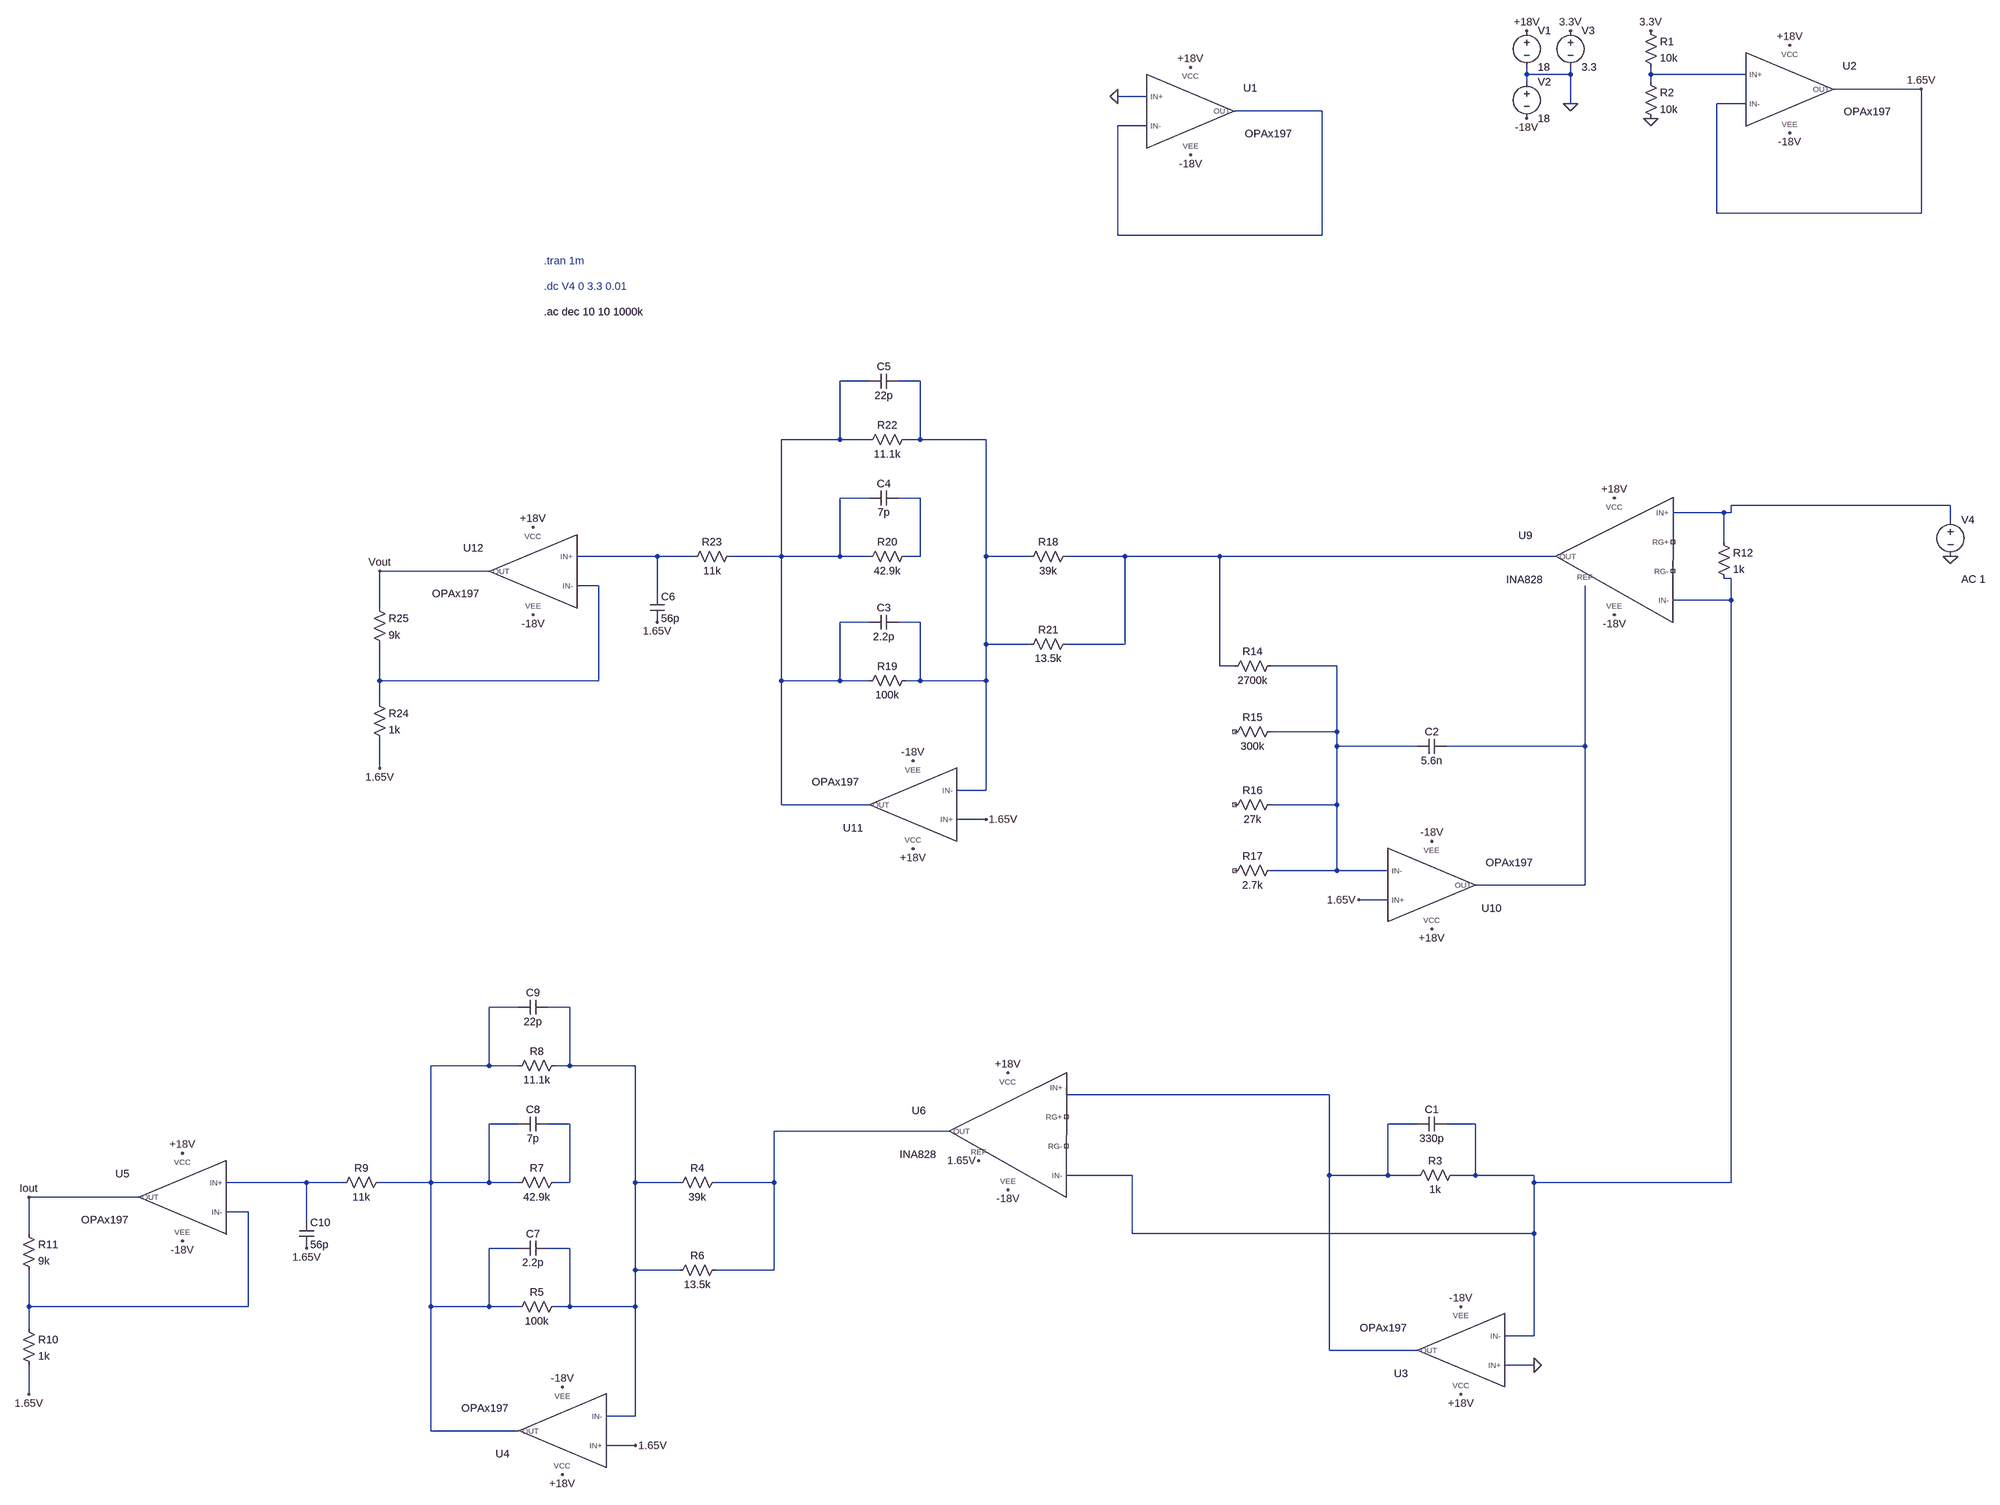
[diagram p0: schematic big.asc]
big.asc, the LTspice schematic file:
Version 4.1
SHEET 1 2076 5472
WIRE 896 48 896 32
WIRE 992 48 992 32
WIRE 992 48 896 48
WIRE 1168 48 1168 32
WIRE 1376 48 1168 48
WIRE 896 64 896 48
WIRE 1168 64 1168 48
WIRE 1760 80 1568 80
WIRE 64 96 0 96
WIRE 992 112 992 48
WIRE 1376 112 1312 112
WIRE 448 128 256 128
WIRE 64 160 0 160
WIRE 1312 352 1312 112
WIRE 1760 352 1760 80
WIRE 1760 352 1312 352
WIRE 0 400 0 160
WIRE 448 400 448 128
WIRE 448 400 0 400
WIRE -544 2048 -608 2048
WIRE -432 2048 -480 2048
WIRE -608 2176 -608 2048
WIRE -608 2176 -736 2176
WIRE -544 2176 -608 2176
WIRE -432 2176 -432 2048
WIRE -432 2176 -464 2176
WIRE -288 2176 -432 2176
WIRE -544 2304 -608 2304
WIRE -432 2304 -480 2304
WIRE 1824 2320 1344 2320
WIRE 1328 2336 1216 2336
WIRE 1344 2336 1344 2320
WIRE 1344 2336 1328 2336
WIRE 1824 2352 1824 2320
WIRE 1328 2400 1328 2336
WIRE -1008 2432 -1184 2432
WIRE -928 2432 -1008 2432
WIRE -736 2432 -736 2176
WIRE -736 2432 -848 2432
WIRE -608 2432 -608 2304
WIRE -608 2432 -736 2432
WIRE -544 2432 -608 2432
WIRE -432 2432 -432 2304
WIRE -432 2432 -464 2432
WIRE -288 2432 -288 2176
WIRE -192 2432 -288 2432
WIRE 16 2432 -112 2432
WIRE 224 2432 16 2432
WIRE 960 2432 224 2432
WIRE -1376 2464 -1616 2464
WIRE 1344 2480 1328 2480
WIRE -1136 2496 -1184 2496
WIRE -1008 2512 -1008 2432
WIRE 1344 2528 1344 2480
WIRE 1344 2528 1216 2528
WIRE -1616 2544 -1616 2464
WIRE -544 2576 -608 2576
WIRE -432 2576 -480 2576
WIRE -288 2624 -288 2432
WIRE -192 2624 -288 2624
WIRE 16 2624 16 2432
WIRE 16 2624 -112 2624
WIRE 224 2672 224 2432
WIRE 256 2672 224 2672
WIRE 480 2672 336 2672
WIRE -1616 2704 -1616 2624
WIRE -1136 2704 -1136 2496
WIRE -1136 2704 -1616 2704
WIRE -736 2704 -736 2432
WIRE -608 2704 -608 2576
WIRE -608 2704 -736 2704
WIRE -544 2704 -608 2704
WIRE -432 2704 -432 2576
WIRE -432 2704 -464 2704
WIRE -288 2704 -288 2624
WIRE -288 2704 -432 2704
WIRE -1616 2752 -1616 2704
WIRE 480 2816 480 2672
WIRE 480 2816 336 2816
WIRE 480 2848 480 2816
WIRE 656 2848 480 2848
WIRE 1024 2848 1024 2496
WIRE 1024 2848 720 2848
WIRE -1616 2896 -1616 2832
WIRE -288 2944 -288 2704
WIRE -288 2944 -352 2944
WIRE -736 2976 -736 2704
WIRE -544 2976 -736 2976
WIRE 480 2976 480 2848
WIRE 480 2976 336 2976
WIRE -288 3008 -352 3008
WIRE 480 3120 480 2976
WIRE 480 3120 336 3120
WIRE 592 3120 480 3120
WIRE 1024 3152 1024 2848
WIRE 1024 3152 784 3152
WIRE 592 3184 528 3184
WIRE -1312 3616 -1376 3616
WIRE -1200 3616 -1248 3616
WIRE -1376 3744 -1376 3616
WIRE -1376 3744 -1504 3744
WIRE -1312 3744 -1376 3744
WIRE -1200 3744 -1200 3616
WIRE -1200 3744 -1232 3744
WIRE -1056 3744 -1200 3744
WIRE -112 3808 -112 3792
WIRE 464 3808 -112 3808
WIRE -1312 3872 -1376 3872
WIRE -1200 3872 -1248 3872
WIRE 656 3872 592 3872
WIRE 784 3872 720 3872
WIRE -368 3888 -752 3888
WIRE 32 3984 -112 3984
WIRE 464 3984 464 3808
WIRE 592 3984 592 3872
WIRE 592 3984 464 3984
WIRE 656 3984 592 3984
WIRE 784 3984 784 3872
WIRE 784 3984 736 3984
WIRE 912 3984 784 3984
WIRE -1776 4000 -1952 4000
WIRE -1696 4000 -1776 4000
WIRE -1504 4000 -1504 3744
WIRE -1504 4000 -1616 4000
WIRE -1376 4000 -1376 3872
WIRE -1376 4000 -1504 4000
WIRE -1312 4000 -1376 4000
WIRE -1200 4000 -1200 3872
WIRE -1200 4000 -1232 4000
WIRE -1056 4000 -1056 3744
WIRE -960 4000 -1056 4000
WIRE -752 4000 -752 3888
WIRE -752 4000 -880 4000
WIRE 912 4000 912 3984
WIRE 1344 4000 1344 2528
WIRE 1344 4000 912 4000
WIRE -2144 4032 -2384 4032
WIRE -1904 4064 -1952 4064
WIRE -1776 4080 -1776 4000
WIRE -2384 4112 -2384 4032
WIRE 32 4112 32 3984
WIRE 912 4112 912 4000
WIRE 912 4112 32 4112
WIRE -1312 4144 -1376 4144
WIRE -1200 4144 -1248 4144
WIRE -1056 4192 -1056 4000
WIRE -960 4192 -1056 4192
WIRE -752 4192 -752 4000
WIRE -752 4192 -880 4192
WIRE -2384 4272 -2384 4192
WIRE -1904 4272 -1904 4064
WIRE -1904 4272 -2384 4272
WIRE -1504 4272 -1504 4000
WIRE -1376 4272 -1376 4144
WIRE -1376 4272 -1504 4272
WIRE -1312 4272 -1376 4272
WIRE -1200 4272 -1200 4144
WIRE -1200 4272 -1232 4272
WIRE -1056 4272 -1056 4192
WIRE -1056 4272 -1200 4272
WIRE -2384 4320 -2384 4272
WIRE 912 4336 912 4112
WIRE 912 4336 848 4336
WIRE 464 4368 464 3984
WIRE 656 4368 464 4368
WIRE 912 4400 848 4400
WIRE -2384 4464 -2384 4400
WIRE -1056 4512 -1056 4272
WIRE -1056 4512 -1120 4512
WIRE -1504 4544 -1504 4272
WIRE -1312 4544 -1504 4544
WIRE -1056 4576 -1120 4576
FLAG 992 112 0
FLAG 896 -48 +18V
FLAG 896 144 -18V
FLAG 160 32 +18V
FLAG 160 224 -18V
FLAG 0 96 0
FLAG 992 -48 3.3V
FLAG 1472 -16 +18V
FLAG 1472 176 -18V
FLAG 1168 144 0
FLAG 1168 -48 3.3V
FLAG 1760 80 1.65V
FLAG 688 3248 +18V
FLAG 688 3056 -18V
FLAG 528 3184 1.65V
FLAG 1088 2560 -18V
FLAG 1088 2304 +18V
FLAG -448 3072 +18V
FLAG -448 2880 -18V
FLAG -288 3008 1.65V
FLAG -1008 2576 1.65V
FLAG -1280 2368 +18V
FLAG -1280 2560 -18V
FLAG -1616 2464 Vout
FLAG 752 4464 +18V
FLAG 752 4272 -18V
FLAG -1216 4640 +18V
FLAG -1216 4448 -18V
FLAG -1056 4576 1.65V
FLAG -1776 4144 1.65V
FLAG -2048 3936 +18V
FLAG -2048 4128 -18V
FLAG -2384 4032 Iout
FLAG -1616 2896 1.65V
FLAG -2384 4464 1.65V
FLAG 1824 2432 0
FLAG -240 4016 -18V
FLAG -240 3760 +18V
FLAG 912 4400 0
FLAG -304 3952 1.65V
DATAFLAG 384 128 ""
SYMBOL lib\\sym\\OPAx197 160 128 R0
SYMATTR InstName U1
SYMBOL voltage 896 -64 R0
WINDOW 123 0 0 Left 0
WINDOW 39 0 0 Left 0
SYMATTR InstName V1
SYMATTR Value 18
SYMBOL voltage 896 48 R0
WINDOW 123 0 0 Left 0
WINDOW 39 0 0 Left 0
SYMATTR InstName V2
SYMATTR Value 18
SYMBOL voltage 992 -64 R0
WINDOW 123 0 0 Left 0
WINDOW 39 0 0 Left 0
SYMATTR InstName V3
SYMATTR Value 3.3
SYMBOL lib\\sym\\OPAx197 1472 80 R0
SYMATTR InstName U2
SYMBOL res 1152 -64 R0
SYMATTR InstName R1
SYMATTR Value 10k
SYMBOL res 1152 48 R0
SYMATTR InstName R2
SYMATTR Value 10k
SYMBOL lib\\sym\\INA828 1088 2432 M0
SYMATTR InstName U9
SYMBOL res 352 2656 R90
WINDOW 0 0 56 VBottom 2
WINDOW 3 32 56 VTop 2
SYMATTR InstName R14
SYMATTR Value 2700k
SYMBOL res 352 2800 R90
WINDOW 0 0 56 VBottom 2
WINDOW 3 32 56 VTop 2
SYMATTR InstName R15
SYMATTR Value 300k
SYMBOL res 352 2960 R90
WINDOW 0 0 56 VBottom 2
WINDOW 3 32 56 VTop 2
SYMATTR InstName R16
SYMATTR Value 27k
SYMBOL res 352 3104 R90
WINDOW 0 0 56 VBottom 2
WINDOW 3 32 56 VTop 2
SYMATTR InstName R17
SYMATTR Value 2.7k
SYMBOL lib\\sym\\OPAx197 688 3152 M180
SYMATTR InstName U10
SYMBOL cap 720 2832 R90
WINDOW 0 0 32 VBottom 2
WINDOW 3 32 32 VTop 2
SYMATTR InstName C2
SYMATTR Value 5.6n
SYMBOL res -96 2416 R90
WINDOW 0 0 56 VBottom 2
WINDOW 3 32 56 VTop 2
SYMATTR InstName R18
SYMATTR Value 39k
SYMBOL lib\\sym\\OPAx197 -448 2976 R180
SYMATTR InstName U11
SYMBOL res -448 2688 R90
WINDOW 0 0 56 VBottom 2
WINDOW 3 32 56 VTop 2
SYMATTR InstName R19
SYMATTR Value 100k
SYMBOL cap -480 2560 R90
WINDOW 0 0 32 VBottom 2
WINDOW 3 32 32 VTop 2
SYMATTR InstName C3
SYMATTR Value 2.2p
SYMBOL res -96 2608 R90
WINDOW 0 0 56 VBottom 2
WINDOW 3 32 56 VTop 2
SYMATTR InstName R21
SYMATTR Value 13.5k
SYMBOL res -448 2416 R90
WINDOW 0 0 56 VBottom 2
WINDOW 3 32 56 VTop 2
SYMATTR InstName R20
SYMATTR Value 42.9k
SYMBOL cap -480 2288 R90
WINDOW 0 0 32 VBottom 2
WINDOW 3 32 32 VTop 2
SYMATTR InstName C4
SYMATTR Value 7p
SYMBOL res -448 2160 R90
WINDOW 0 0 56 VBottom 2
WINDOW 3 32 56 VTop 2
SYMATTR InstName R22
SYMATTR Value 11.1k
SYMBOL cap -480 2032 R90
WINDOW 0 0 32 VBottom 2
WINDOW 3 32 32 VTop 2
SYMATTR InstName C5
SYMATTR Value 22p
SYMBOL res -832 2416 R90
WINDOW 0 0 56 VBottom 2
WINDOW 3 32 56 VTop 2
SYMATTR InstName R23
SYMATTR Value 11k
SYMBOL cap -1024 2512 R0
SYMATTR InstName C6
SYMATTR Value 56p
SYMBOL lib\\sym\\OPAx197 -1280 2464 M0
SYMATTR InstName U12
SYMBOL res -1632 2736 R0
SYMATTR InstName R24
SYMATTR Value 1k
SYMBOL res -1632 2528 R0
SYMATTR InstName R25
SYMATTR Value 9k
SYMBOL voltage 1824 2336 R0
WINDOW 123 24 146 Left 2
WINDOW 39 0 0 Left 0
SYMATTR InstName V4
SYMATTR Value ""
SYMATTR Value2 AC 1
SYMBOL lib\\sym\\OPAx197 752 4368 R180
SYMATTR InstName U3
SYMBOL res 752 3968 R90
WINDOW 0 0 56 VBottom 2
WINDOW 3 32 56 VTop 2
SYMATTR InstName R3
SYMATTR Value 1k
SYMBOL cap 720 3856 R90
WINDOW 0 0 32 VBottom 2
WINDOW 3 32 32 VTop 2
SYMATTR InstName C1
SYMATTR Value 330p
SYMBOL res -864 3984 R90
WINDOW 0 0 56 VBottom 2
WINDOW 3 32 56 VTop 2
SYMATTR InstName R4
SYMATTR Value 39k
SYMBOL lib\\sym\\OPAx197 -1216 4544 R180
SYMATTR InstName U4
SYMBOL res -1216 4256 R90
WINDOW 0 0 56 VBottom 2
WINDOW 3 32 56 VTop 2
SYMATTR InstName R5
SYMATTR Value 100k
SYMBOL cap -1248 4128 R90
WINDOW 0 0 32 VBottom 2
WINDOW 3 32 32 VTop 2
SYMATTR InstName C7
SYMATTR Value 2.2p
SYMBOL res -864 4176 R90
WINDOW 0 0 56 VBottom 2
WINDOW 3 32 56 VTop 2
SYMATTR InstName R6
SYMATTR Value 13.5k
SYMBOL res -1216 3984 R90
WINDOW 0 0 56 VBottom 2
WINDOW 3 32 56 VTop 2
SYMATTR InstName R7
SYMATTR Value 42.9k
SYMBOL cap -1248 3856 R90
WINDOW 0 0 32 VBottom 2
WINDOW 3 32 32 VTop 2
SYMATTR InstName C8
SYMATTR Value 7p
SYMBOL res -1216 3728 R90
WINDOW 0 0 56 VBottom 2
WINDOW 3 32 56 VTop 2
SYMATTR InstName R8
SYMATTR Value 11.1k
SYMBOL cap -1248 3600 R90
WINDOW 0 0 32 VBottom 2
WINDOW 3 32 32 VTop 2
SYMATTR InstName C9
SYMATTR Value 22p
SYMBOL res -1600 3984 R90
WINDOW 0 0 56 VBottom 2
WINDOW 3 32 56 VTop 2
SYMATTR InstName R9
SYMATTR Value 11k
SYMBOL cap -1792 4080 R0
SYMATTR InstName C10
SYMATTR Value 56p
SYMBOL lib\\sym\\OPAx197 -2048 4032 M0
SYMATTR InstName U5
SYMBOL res -2400 4304 R0
SYMATTR InstName R10
SYMATTR Value 1k
SYMBOL res -2400 4096 R0
SYMATTR InstName R11
SYMATTR Value 9k
SYMBOL res 1312 2384 R0
SYMATTR InstName R12
SYMATTR Value 1k
SYMBOL lib\\sym\\INA828 -240 3888 M0
SYMATTR InstName U6
TEXT -1256 456 Left 2 ;.tran 1m
TEXT -1256 512 Left 2 ;.dc V4 0 3.3 0.01
TEXT -1256 568 Left 2 !.ac dec 10 10 1000k

The netlist it stands for:
* big.asc
X§U1 0 N002 +18V -18V N002 OPAx197  ; pins IN+ IN- VCC VEE OUT
V1 +18V 0 18
V2 0 -18V 18
V3 3.3V 0 3.3
X§U2 N001 1.65V +18V -18V 1.65V OPAx197  ; pins IN+ IN- VCC VEE OUT
R1 3.3V N001 10k
R2 N001 0 10k
X§U9 N006 N009 +18V -18V N008 N012 NC_01 NC_02 INA828  ; pins IN+ IN- VCC VEE OUT REF RG+ RG-
R14 N011 N008 2700k
R15 N011 NC_03 300k
R16 N011 NC_04 27k
R17 N011 NC_05 2.7k
X§U10 1.65V N011 +18V -18V N012 OPAx197  ; pins IN+ IN- VCC VEE OUT
C2 N012 N011 5.6n
R18 N008 N004 39k
X§U11 1.65V N004 +18V -18V N003 OPAx197  ; pins IN+ IN- VCC VEE OUT
R19 N004 N003 100k
C3 N004 N003 2.2p
R21 N008 N004 13.5k
R20 N005 N003 42.9k
C4 N005 N003 7p
R22 N004 N003 11.1k
C5 N004 N003 22p
R23 N003 N007 11k
C6 N007 1.65V 56p
X§U12 N007 N010 +18V -18V Vout OPAx197  ; pins IN+ IN- VCC VEE OUT
R24 N010 1.65V 1k
R25 Vout N010 9k
V4 N006 0 AC 1
X§U3 0 N009 +18V -18V N015 OPAx197  ; pins IN+ IN- VCC VEE OUT
R3 N009 N015 1k
C1 N009 N015 330p
R4 N017 N014 39k
X§U4 1.65V N014 +18V -18V N013 OPAx197  ; pins IN+ IN- VCC VEE OUT
R5 N014 N013 100k
C7 N014 N013 2.2p
R6 N017 N014 13.5k
R7 N016 N013 42.9k
C8 N016 N013 7p
R8 N014 N013 11.1k
C9 N014 N013 22p
R9 N013 N018 11k
C10 N018 1.65V 56p
X§U5 N018 N019 +18V -18V Iout OPAx197  ; pins IN+ IN- VCC VEE OUT
R10 N019 1.65V 1k
R11 Iout N019 9k
R12 N006 N009 1k
X§U6 N015 N009 +18V -18V N017 1.65V NC_06 NC_07 INA828  ; pins IN+ IN- VCC VEE OUT REF RG+ RG-
* .tran 1m
* .dc V4 0 3.3 0.01
.ac dec 10 10 1000k
.lib OPAx197.LIB
.lib INA828.LIB
.backanno
.end